# Altium schematic sheet SH5 - 5V VICOR DCDC.SchDoc: Power Distribution Board Rev2 - 5V Vicor DCDC
size Letter; DrawnBy: Cindy Li; Organization: UW Robotics; Address1: 200 University Avenue; Address2: Waterloo; Address3: Ontario; Address4: Canada N2L 3G6; DocumentNumber: 5; SheetNumber: 5; SheetTotal: 11
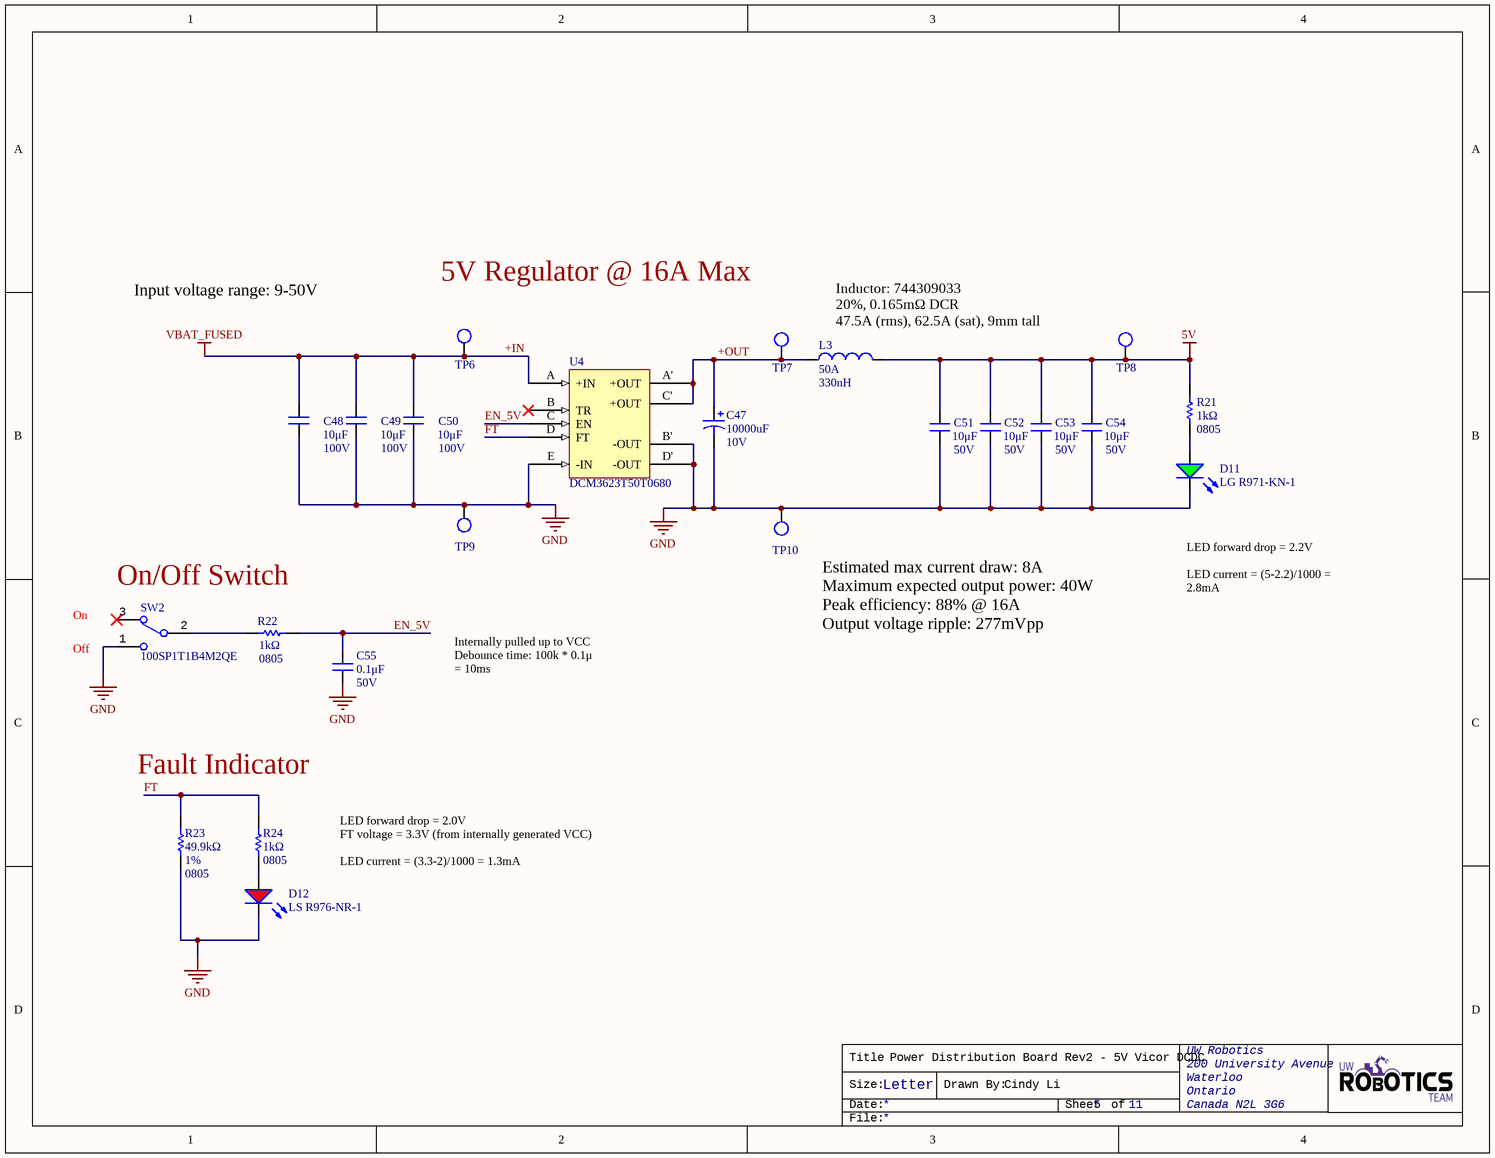
[diagram p0: SH5 - 5V VICOR DCDC.SchDoc]

## Parts
C47  Capacitance: 10000uF  Voltage Rating: 10V  [CAP_UBY_18X25_NC]  (hidden comment: URS1A103MHD1TN)
C48  value 10μF  Voltage Rating: 100V  [CAP1210]  (hidden comment: CAP_10uF_100V_1210)
C49  value 10μF  Voltage Rating: 100V  [CAP1210]  (hidden comment: CAP_10uF_100V_1210)
C50  value 10μF  Voltage Rating: 100V  [CAP1210]  (hidden comment: CAP_10uF_100V_1210)
C51  value 10μF  Voltage Rating: 50V  [CAP1210]  (hidden comment: CAP_10uF_50V_1210)
C52  value 10μF  Voltage Rating: 50V  [CAP1210]  (hidden comment: CAP_10uF_50V_1210)
C53  value 10μF  Voltage Rating: 50V  [CAP1210]  (hidden comment: CAP_10uF_50V_1210)
C54  value 10μF  Voltage Rating: 50V  [CAP1210]  (hidden comment: CAP_10uF_50V_1210)
C55  0.1μF  Voltage Rating: 50V  [CAP2012]
D11  LG R971-KN-1  [LED_0805_GREEN]
D12  LS R976-NR-1  [LED_0805_RED]
L3  Max DC Current: 50A  Inductance: 330nH  [WE-HCM 1390]  (hidden comment: 744309033)
R21  1kΩ  Case Code (Imperial): 0805  [RESC2012X60N]
R22  1kΩ  Case Code (Imperial): 0805  [RESC2012X60N]
R23  49.9kΩ  Tolerance: 1%  Case Code (Imperial): 0805  [RESC2012X60N]
R24  1kΩ  Case Code (Imperial): 0805  [RESC2012X60N]
SW2  100SP1T1B4M2QE  [100SP1T1B4M2QE]
TP6  TESTPOINT_LOOP  [TESTPOINT_LOOP]  (value not drawn)
TP7  TESTPOINT_LOOP  [TESTPOINT_LOOP]  (value not drawn)
TP8  TESTPOINT_LOOP  [TESTPOINT_LOOP]  (value not drawn)
TP9  TESTPOINT_LOOP  [TESTPOINT_LOOP]  (value not drawn)
TP10  TESTPOINT_LOOP  [TESTPOINT_LOOP]  (value not drawn)
U4  DCM3623T50T0680  [DCM3623T50T0680]

## Nets
5V: C51.2 C52.2 C53.2 C54.2 L3.2 R21.2 TP8.1
+IN: C48.2 C49.2 C50.2 TP6.1 U4.A(+IN)  [also labelled VBAT_FUSED]
GND: C47.2 C48.1 C49.1 C50.1 C51.1 C52.1 C53.1 C54.1 C55.1 D11.2(K) D12.2(K) R23.2 SW2.1 TP9.1 TP10.1 U4.B'(-OUT) U4.D'(-OUT) U4.E(-IN)
+OUT: C47.1 L3.1 TP7.1 U4.A'(+OUT) U4.C'(+OUT)
EN_5V: C55.2 R22.2 U4.C(EN)
FT: R23.1 R24.2 U4.D(FT)
NetD11_1: D11.1(A) R21.1
NetD12_1: D12.1(A) R24.1
NetR22_1: R22.1 SW2.2

Not connected (* = marked no-connect by the designer): SW2 3*; U4 B(TR)*

## Notes on the sheet
- Input voltage range: 9-50V
- 5V Regulator @ 16A Max
- Inductor: 744309033
  20%, 0.165mΩ DCR
  47.5A (rms), 62.5A (sat), 9mm tall
- On
- On/Off Switch
- (near TP10) Estimated max current draw: 8A
  Maximum expected output power: 40W
  Peak efficiency: 88% @ 16A
  Output voltage ripple: 277mVpp
- LED forward drop = 2.2V
  LED current = (5-2.2)/1000 = 2.8mA
- (near SW2) Off
- Internally pulled up to VCC
  Debounce time: 100k * 0.1μ = 10ms
- Fault Indicator
- LED forward drop = 2.0V
  FT voltage = 3.3V (from internally generated VCC)
  LED current = (3.3-2)/1000 = 1.3mA
- Title
- Size:
- Date:
- Letter
- Drawn By:
- Sheet
- of
- File:

## Library data of the parts
C47 = URS1A103MHD1TN: CAP ALUM 10000UF 20% 10V RADIAL; Manufacturer 1: Nichicon; Ripple Current: 2.35A; Life (Hours): 2000Hour; Supplier 1: Digi-Key; Manufacturer Part Number 1: URS1A103MHD1TN; Mount: Through Hole; Case/Package: Radial; Min Operating Temperature: -40°C; Max Operating Temperature: 85°C; Tolerance: 20%; Lead Pitch: 0.295inch; Height - Seated (Max): 1.043inch; Supplier Part Number 1: 493-12364-1-ND
C48-C50 = CAP_10uF_100V_1210: CAP CER 10uF 100V X7S 10% 1210; Manufacturer 1: Murata; Manufacturer Part Number 1: GRM32EC72A106KE05L; Supplier Part Number 1: 490-16266-1-ND; Supplier 1: Digi-Key; Category: Ceramic Capacitors; Mount: Surface Mount; Case Code (Metric): 3225; Case Code (Imperial): 1210; Min Operating Temperature: -55°C; Max Operating Temperature: 125°C; Dielectric: X7S; Tolerance: 10%; Package: 1210 (3225 Metric)
C51-C54 = CAP_10uF_50V_1210: CAP CER 10UF 50V X7R 1210; Manufacturer 1: Murata Electronics; Manufacturer Part Number 1: GRM32ER71H106MA12L; Tolerance: 20%; Supplier 1: Digi-Key; Mount: Surface Mount; Min Operating Temperature: -55°C; Max Operating Temperature: 125°C; Termination: SMD/SMT; Dielectric: X7R; Supplier Part Number 1: 490-12775-1-ND; Package: 1210 (3225 Metric); Case Code (Metric): 3225; Case Code (Imperial): 1210
C55 = CAP_0.1uF_50V_0805: CAP CER 0.1UF 50V X7R 0805; Manufacturer Part Number 1: GCD21BR71H104KA01L; Manufacturer 1: Murata Electronics; Tolerance: 10%; Package: 0805 (2012 Metric); Supplier Part Number 1: 490-11955-1-ND; Supplier 1: Digi-Key; Mount: Surface Mount; Value: 0.1μF; Case Code (Imperial): 0805; Case Code (Metric): 2012; Dielectric: X7R; Min Operating Temperature: -55°C; Max Operating Temperature: 125°C; Termination: SMD/SMT; Length: 2mm; Height: 1.25mm; Width: 0.049inch; Thickness: 0.049inch; Depth: 1.25mm; Ratings: AEC-Q200
D11 = DIO_LED_G: LED GREEN DIFFUSED 0805 SMD; Manufacturer 1: OSRAM; Forward Voltage Drop: 2.2V; Package: 0805 (2012 Metric); Manufacturer Part Number 1: LG R971-KN-1; Supplier Part Number 1: 475-1410-1-ND; Supplier 1: Digi-Key; Mount: Surface Mount
D12 = DIO_LED_R: LED RED DIFFUSED 0805 SMD; Manufacturer 1: OSRAM; Forward Voltage Drop: 2V; Package: 0805 (2012 Metric); Manufacturer Part Number 1: LS R976-NR-1; Supplier Part Number 1: 475-1278-1-ND; Supplier 1: Digi-Key; Mount: Surface Mount
L3 = 744309033: IND 330NH 47.5A 0.165 MOHM; Manufacturer 1: Wurth Electronics; Core Material: Zinc; Inductance Tolerance: 20%; Self Resonant Frequency: 158MHz; Saturation Current: 62.5A; Shielding: Shielded; DC Resistance (DCR): 0.165mR; Test Frequency: 100kHz; Supplier 1: Newark; Manufacturer Part Number 1: 744309033; Mount: Surface Mount; Case/Package: Nonstandard; Min Operating Temperature: -40°C; Max Operating Temperature: 125°C; Current Rating: 47.5A; Tolerance: 20%; Composition: Wirewound; Termination: SMD/SMT; RMS Current (Irms): 50A; Length: 0.551inch; Height: 9mm; Width: 0.512inch; Height - Seated (Max): 0.374inch; REACH SVHC: Unknown
R21 R22 R24 = RES_1kΩ_0805_1%: RES 1K OHM 1% 1/8W 0805; Manufacturer 1: Yageo; Manufacturer Part Number 1: RC0805FR-071KL; Power Rating: 125mW; Temperature Coefficient: 25ppm/°C; Voltage Rating: 150V; Tolerance: 1%; Package: 0805 (2012 Metric); Supplier Part Number 1: 311-1.00KCRCT-ND; Supplier 1: Digi-Key; Value: 1kΩ; Case Code (Metric): 2012; Min Operating Temperature: -55°C; Max Operating Temperature: 155°C; Resistance: 1K; Termination: SMD/SMT; Mount: Surface Mount; Case/Package: 0805; Number of Pins: 2; Weight: 0.000194oz; Contact Plating: Tin; Composition: Thin Film; Number of Terminations: 2; Voltage Rating (DC): 150V; Max Power Dissipation: 125mW; Features: Moisture Resistant,Automotive AEC-Q200,Anti-Sulfur; Military Standard: Not; Length: 2mm; Height: 0.022inch; Width: 0.049inch; Depth: 1.25mm; REACH SVHC: Unknown
R23 = RES_49.9kΩ_0805_1%: RES 49.9K OHM 1% 1/8W 0805; Manufacturer Part Number 1: TNPW080549K9BEEN; Manufacturer 1: Vishay Dale; Power Rating: 125mW; Voltage Rating: 150V; Temperature Coefficient: 25ppm/°C; Resistance: 49.9kR; Supplier 1: Digi-Key; Mount: Surface Mount; Number of Pins: 2; Min Operating Temperature: -55°C; Max Operating Temperature: 125°C; Composition: Thin Film; Termination: SMD/SMT; Military Standard: Not; Voltage Rating (DC): 150V; Length: 2mm; Height: 0.022inch; Width: 0.049inch; Supplier Part Number 1: 541-3802-1-ND; Package: 0805 (2012 Metric); Case Code (Metric): 2012; Depth: 1.25mm; Weight: 0.000194oz; Contact Plating: Tin; Number of Terminations: 2; Max Power Dissipation: 125mW; Features: Moisture Resistant,Automotive AEC-Q200,Anti-Sulfur; REACH SVHC: Unknown
SW2 = SW_SPDT: SWITCH TOGGLE SPDT 5A 120V; Manufacturer 1: E-Switch; Actuator Material: Brass,Chrome; Electrical Life: 40000Cycles; Actuator Type: Standard Round; Voltage Rating (DC): 28V; Illumination Type: Non-Illuminated,Illuminated; Switch Function: On-On; Actuator Length: 12.19mm; Supplier 1: Digi-Key; Manufacturer Part Number 1: 100SP1T1B4M2QE; Mount: Through Hole; Contact Material: Silver; Contact Plating: Silver; Min Operating Temperature: -30°C; Max Operating Temperature: 85°C; Termination: PC Pin; Throw Configuration: SPDT; Orientation: Vertical; Voltage Rating (AC): 120V; Supplier Part Number 1: EG2355-ND; Current Rating: 5A
TP6-TP10 = TESTPOINT_LOOP: PC TEST POINT MINIATURE WHITE; Manufacturer 1: Keystone Electronics; Manufacturer Part Number 1: 5002; Supplier 1: Digi-Key; Mount: Through Hole; Supplier Part Number 1: 36-5002-ND
U4 = DCM3623T50T0680: DC DC CONVERTER 5V 80W